# Altium schematic sheet PIC32ETH_Usb.SchDoc: Usb
size A4; SheetNumber: 4
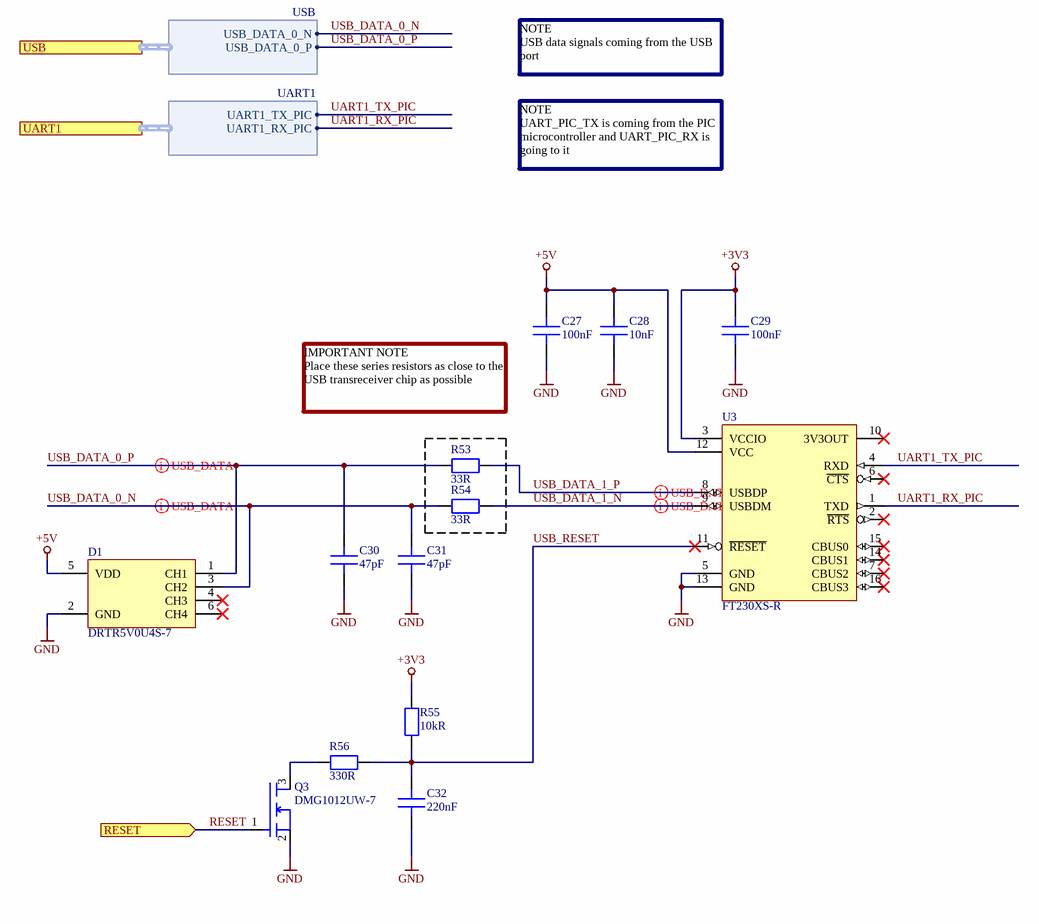
[diagram p0: PIC32ETH_Usb.SchDoc]

## Parts
C27  100nF  [C_CHIP2012N]
C28  10nF  [C_CHIP2012N]
C29  100nF  [C_CHIP2012N]
C30  47pF  [C_CHIP2012N]
C31  47pF  [C_CHIP2012N]
C32  220nF  [C_CHIP2012N]
D1  DRTR5V0U4S-7  [D_SOT65P210X100-6N]
Q3  DMG1012UW-7  [Q_SOT65P210X100-3N]
R53  33R  [R_CHIP2012N]
R54  33R  [R_CHIP2012N]
R55  10kR  [R_CHIP2012N]
R56  330R  [R_CHIP2012N]
U3  FT230XS-R  [U_TSOP64P600X135-16N]

## Ports
RESET (in), UART1 (harness UART1), USB (harness USB)

## Harnesses
USB: USB_DATA_0_P, USB_DATA_0_N
UART1: UART1_RX_PIC, UART1_TX_PIC

## Nets
+3V3: C29.1 R55.2 U3.3(VCCIO)
+5V: C27.1 C28.2 D1.5(VDD) U3.12(VCC)
GND: C27.2 C28.1 C29.2 C30.1 C31.1 C32.1 D1.2(GND) Q3.2(S) U3.5(GND) U3.13(GND)
RESET: Q3.1(G) ; port RESET
UART1_RX_PIC: U3.1(TXD) ; port UART1.UART1_RX_PIC
UART1_TX_PIC: U3.4(RXD) ; port UART1.UART1_TX_PIC
USB_DATA_0_N: C31.2 D1.3(CH2) R54.1 ; port USB.USB_DATA_0_N
USB_DATA_0_P: C30.2 D1.1(CH1) R53.1 ; port USB.USB_DATA_0_P
USB_DATA_1_N: R54.2 U3.9(USBDM)
USB_DATA_1_P: R53.2 U3.8(USBDP)
USB_RESET: C32.2 R55.1 R56.2 U3.11(~{RESET})
NetQ3_3: Q3.3(D) R56.1

Not connected (* = marked no-connect by the designer): D1 4(CH3)* 6(CH4)*; U3 2(~{RTS})* 6(~{CTS})* 7(CBUS2)* 10(3V3OUT)* 14(CBUS1)* 15(CBUS0)* 16(CBUS3)*

## Layout directives
differential pair; differential pair class USB_DATA: USB_DATA_0_N, USB_DATA_0_P, USB_DATA_1_N, USB_DATA_1_P

## Notes on the sheet
- NOTE
  USB data signals coming from the USB port
- NOTE
  UART_PIC_TX is coming from the PIC microcontroller and UART_PIC_RX is going to it
- IMPORTANT NOTE
  Place these series resistors as close to the USB transreceiver chip as possible
- Project:
- Doc Nr:
- File:
- Drawn:
- Rev:
- Date:
- Size:
- Sheet:
- A4
- of

## Library data of the parts
C27 C29 = C_C0805C104K5RACTU: C CERAMIC 100nF 50V 10% 2012; Manufacturer: Kemet; Dielectric: X7R; Tolerance: +/-10%; Datasheet Url: https://content.kemet.com/datasheets/KEM_C1002_X7R_SMD.pdf; Mounting: SMT; Package: 2012; Part Number: C0805C104K5RACTU; Price: 0.23; Price Currency: CHF; Supplier 1: Digi-Key; Capacitance: 100nF; Voltage: 50V; Supplier Part Number 1: 399-1170-1-ND; Esr: n/a; Pin Count: 2; Temperature Range: -55degC to 125degC
C28 = C_C0805C103K5RACTU: C CERAMIC 10nF 50V 10% 2012; Manufacturer: Kemet; Dielectric: X7R; Tolerance: +/-10%; Datasheet Url: https://content.kemet.com/datasheets/KEM_C1002_X7R_SMD.pdf; Mounting: SMT; Package: 2012; Part Number: C0805C103K5RACTU; Price: 0.18; Price Currency: CHF; Supplier 1: Digi-Key; Capacitance: 10nF; Voltage: 50V; Supplier Part Number 1: 399-1158-1-ND; Esr: n/a; Pin Count: 2; Temperature Range: -55degC to 125degC
C30 C31 = C_C0805C470K5GACTU: C CERAMIC 47pF 50V 10% 2012; Manufacturer: Kemet; Dielectric: C0G; Tolerance: +/-10%; Datasheet Url: https://api.kemet.com/component-edge/download/datasheet/C0805C470K5GACTU.pdf; Mounting: SMT; Package: 2012; Part Number: C0805C470K5GACTU; Price: 0.11; Price Currency: CHF; Supplier 1: Digi-Key; Capacitance: 47pF; Voltage: 50V; Supplier Part Number 1: 399-8081-1-ND; Esr: n/a; Pin Count: 2; Temperature Range: -55degC to 125degC
C32 = C_C0805C224K5RACTU: C CERAMIC 220nF 50V 10% 2012; Manufacturer: Kemet; Dielectric: X7R; Tolerance: +/-10%; Datasheet Url: https://content.kemet.com/datasheets/KEM_C1002_X7R_SMD.pdf; Mounting: SMT; Package: 2012; Part Number: C0805C224K5RACTU; Price: 0.16; Price Currency: CHF; Supplier 1: Digi-Key; Capacitance: 220nF; Voltage: 50V; Supplier Part Number 1: 399-3491-1-ND; Esr: n/a; Pin Count: 2; Temperature Range: -55degC to 125degC
D1 = D_DRTR5V0U4S-7: D TVS 5.5V 6V 200mW SOT-363; Manufacturer: Diodes Incorporated; Datasheet URL: https://www.diodes.com/assets/Datasheets/DRTR5V0U4S.pdf; Mounting: SMT; Package: SOT-363; Part Number: DRTR5V0U4S-7; Price: 0.39; Price Currency: CHF; Supplier 1: Digi-Key; Supplier Part Number 1: DRTR5V0U4S-7DICT-ND; Temperature Range: -65degC to 150degC; Pin Count: 6; Power: 200mW; Voltage Breakdown: 6V; Voltage Reverse Standoff: 5.5V
Q3 = Q_DMG1012UW-7: Q MOSFET N-CH 20V 1A SOT-323; Manufacturer: Diodes Incorporated; Power: 290mW; Voltage Gate Source: +/-6V; Datasheet Url: https://www.diodes.com/assets/Datasheets/ds31859.pdf; Mounting: SMT; Package: SOT-323; Part Number: DMG1012UW-7; Price: 0.39; Price Currency: CHF; Supplier 1: Digi-Key; Supplier Part Number 1: DMG1012UW-7DICT-ND; Current Drain: 1A; Pin Count: 3; Temperature Range: -55degC to 150degC; Voltage Drain Source: 20V; Mosfet Type: N-CH
R53 R54 = R_RMCF0805FT33R0: R SMT 33R 1% 125mW 2012; Manufacturer: Stackpole Electronics Inc; Temperature Coefficient: 100ppm/degC; Tolerance: +/-1%; Voltage: 150V; Datasheet Url: https://www.seielect.com/catalog/sei-rmcf_rmcp.pdf; Mounting: SMT; Package: 2012; Part Number: RMCF0805FT33R0; Price: 0.10; Price Currency: CHF; Supplier 1: Digi-Key; Resistance: 33R; Supplier Part Number 1: RMCF0805FT33R0CT-ND; Temperature Range: -55degC to 155degC; Pin Count: 2; Power: 125mW
R55 = R_RMCF0805FT10K0: R SMT 10kR 1% 125mW 2012; Manufacturer: Stackpole Electronics Inc; Temperature Coefficient: 100ppm/degC; Tolerance: +/-1%; Voltage: 150V; Datasheet Url: https://www.seielect.com/catalog/sei-rmcf_rmcp.pdf; Mounting: SMT; Package: 2012; Part Number: RMCF0805FT10K0; Price: 0.10; Price Currency: CHF; Supplier 1: Digi-Key; Resistance: 10kR; Power: 125mW; Supplier Part Number 1: RMCF0805FT10K0CT-ND; Pin Count: 2; Temperature Range: -55degC to 155degC
R56 = R_RMCF0805FT330R: R SMT 330R 1% 125mW 2012; Manufacturer: Stackpole Electronics Inc; Temperature Coefficient: 100ppm/degC; Tolerance: +/-1%; Voltage: 150V; Datasheet Url: https://www.seielect.com/catalog/sei-rmcf_rmcp.pdf; Mounting: SMT; Package: 2012; Part Number: RMCF0805FT330R; Price: 0.10; Price Currency: CHF; Supplier 1: Digi-Key; Resistance: 330R; Supplier Part Number 1: RMCF0805FT330RCT-ND; Temperature Range: -55degC to 155degC; Pin Count: 2; Power: 125mW
U3 = U_FT230XS-R: U TRANSCEIVER UART-USB 16-SSOP; Manufacturer: FTDI; Voltage Input: 3.3V to 5V; Datasheet Url: http://www.ftdichip.com/Support/Documents/DataSheets/ICs/DS_FT230X.pdf; Mounting: SMT; Package: 16-SSOP; Part Number: FT230XS-R; Price: 2.02; Price Currency: CHF; Supplier 1: Digi-Key; Pin Count: 16; Supplier Part Number 1: 768-1135-1-ND; Temperature Range: -40degC to 85degC; Transceiver Type: UART-USB